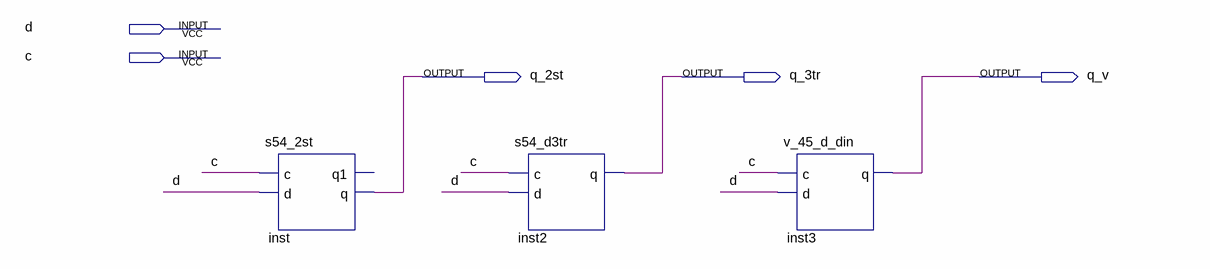
[diagram p0: schematic sheet]
// Quartus schematic ssv54_d_din.bdf as structural Verilog: 3 symbols, 5 pins
module ssv54_d_din (
  input  d,
  input  c,
  output q_2st,
  output q_3tr,
  output q_v
);

  s54_2st inst (.c(c), .d(d), .q(q_2st));  // open: q1
  s54_d3tr inst2 (.c(c), .d(d), .q(q_3tr));
  v_45_d_din inst3 (.c(c), .d(d), .q(q_v));
endmodule
